# Altium schematic sheet SCH_Display_Altium.schdoc
size 307 x 206 mm
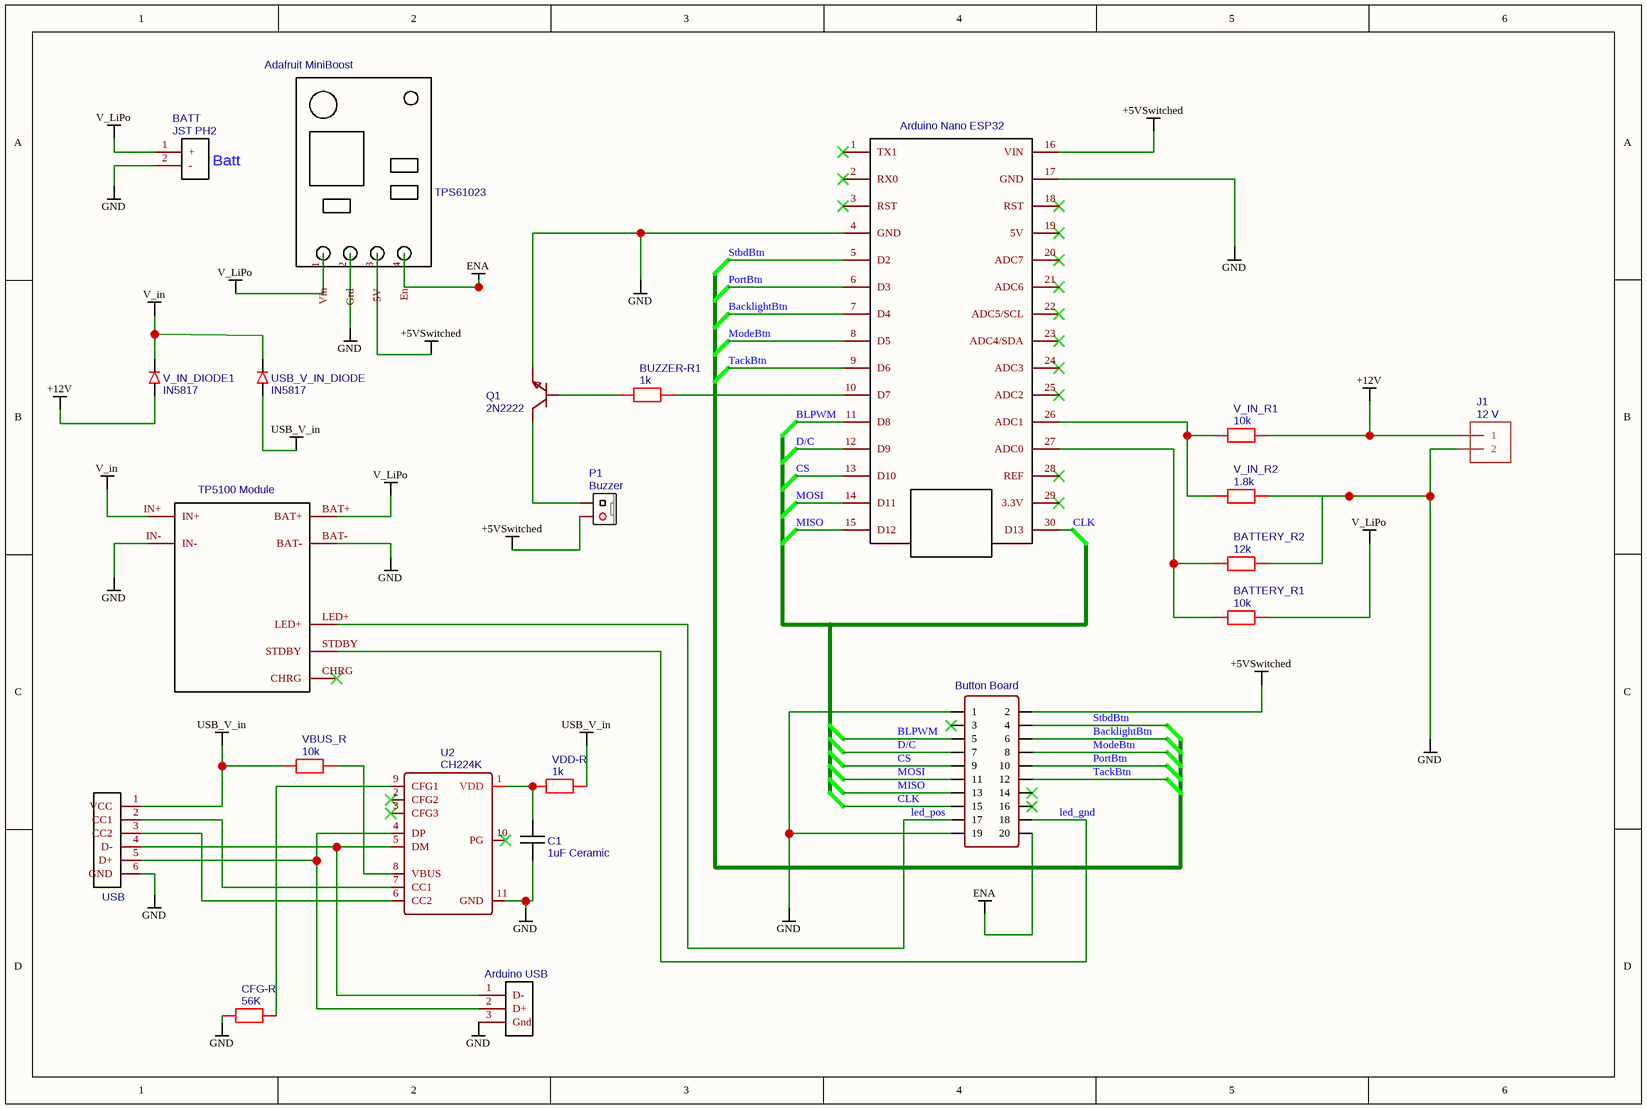
[diagram p0: SCH_Display_Altium.schdoc]

## Parts
BATT  JST PH2  [JST-PH-JST-PH2]
BATTERY_R1  10k  [1K 0.25W]
BATTERY_R2  12k  [1K 0.25W]
BUTTON_LED1  Button Board  [HDR-M-2.54_2X10]
BUZZER-R1  1k  [1K 0.25W]
C1  1uF Ceramic  [CERAMIC CAPACITOR]
CFG-R  56K  [1K 0.25W]
J1  12 V  [1X2-3.5MM]
JST-PH-2.0_1X6  USB  [JST-PH-2.0_1X6]
JST_XH_1X3  Arduino USB  [JST XH 1X3]
P1  Buzzer  [HDR-1X2M-P-2.54MM-JST XH NO]
Q1  2N2222  [TO-92-3_L4.9-W3.7-P1.27-L]
TPS61023  Adafruit MiniBoost  [ADAFRUIT MINIBOOST 5V @ 1A - TPS61023 FOOTPRINT]
U1  Arduino Nano ESP32  [ADUINO NANO R3]
U2  CH224K  [ESSOP-10_L4.9-W3.9-P1.0-LS6.0-TL-EP]
U3  TP5100 Module  [TP5100-MODULE]
USB_V_IN_DIODE  IN5817  [DIODE NI RAMON]
V_IN_DIODE1  IN5817  [DIODE NI RAMON]
V_IN_R1  10k  [1K 0.25W]
V_IN_R2  1.8k  [1K 0.25W]
VBUS_R  10k  [1K 0.25W]
VDD-R  1k  [1K 0.25W]

## Nets
+5VSwitched: BUTTON_LED1.2 P1.2 TPS61023.3(5V) U1.16(VIN)
+12V: J1.1 V_IN_DIODE1.1 V_IN_R1.2
ENA: BUTTON_LED1.20 TPS61023.4(En)
GND: BATT.2(-) BATTERY_R2.2 BUTTON_LED1.1 BUTTON_LED1.19 C1.2 CFG-R.1 J1.2 JST-PH-2.0_1X6.6(GND) JST_XH_1X3.3(Gnd) Q1.1(E) TPS61023.2(Grd) U1.4(GND) U1.17(GND) U2.11(GND) U3.BAT- U3.IN- V_IN_R2.2
USB_V_in: JST-PH-2.0_1X6.1(VCC) USB_V_IN_DIODE.1 VBUS_R.1 VDD-R.2
V_in: U3.IN+ USB_V_IN_DIODE.2 V_IN_DIODE1.2
V_LiPo: BATT.1(+) BATTERY_R1.2 TPS61023.1(Vin) U3.BAT+
BacklightBtn: BUTTON_LED1.6 U1.7(D4)
BLPWM: BUTTON_LED1.5 U1.11(D8)
CLK: BUTTON_LED1.15 U1.30(D13)
CS: BUTTON_LED1.9 U1.13(D10)
D/C: BUTTON_LED1.7 U1.12(D9)
led_gnd: BUTTON_LED1.18 U3.STDBY
led_pos: BUTTON_LED1.17 U3.LED+
MISO: BUTTON_LED1.13 U1.15(D12)
ModeBtn: BUTTON_LED1.8 U1.8(D5)
MOSI: BUTTON_LED1.11 U1.14(D11)
PortBtn: BUTTON_LED1.10 U1.6(D3)
StbdBtn: BUTTON_LED1.4 U1.5(D2)
TackBtn: BUTTON_LED1.12 U1.9(D6)
NetBATTERY_R1_1: BATTERY_R1.1 BATTERY_R2.1 U1.27(ADC0)
NetBUZZER-R1_1: BUZZER-R1.1 Q1.2(B)
NetBUZZER-R1_2: BUZZER-R1.2 U1.10(D7)
NetC1_1: C1.1 U2.1(VDD) VDD-R.1
NetCFG-R_2: CFG-R.2 U2.9(CFG1)
NetJST-PH-2.0_1X6_2: JST-PH-2.0_1X6.2(CC1) U2.7(CC1)
NetJST-PH-2.0_1X6_3: JST-PH-2.0_1X6.3(CC2) U2.6(CC2)
NetJST-PH-2.0_1X6_4: JST-PH-2.0_1X6.4(D-) JST_XH_1X3.1(D-) U2.5(DM)
NetJST-PH-2.0_1X6_5: JST-PH-2.0_1X6.5(D+) JST_XH_1X3.2(D+) U2.4(DP)
NetP1_1: P1.1 Q1.3(C)
NetU1_26: U1.26(ADC1) V_IN_R1.1 V_IN_R2.1
NetU2_8: U2.8(VBUS) VBUS_R.2

Not connected (* = marked no-connect by the designer): BUTTON_LED1 3* 14* 16*; U1 1(TX1)* 2(RX0)* 3(RST)* 18(RST)* 19(5V)* 20(ADC7)* 21(ADC6)* 22(ADC5/SCL)* 23(ADC4/SDA)* 24(ADC3)* 25(ADC2)* 28(REF)* 29(3.3V)*; U2 2(CFG2)* 3(CFG3)* 10(PG)*; U3 CHRG*

## Notes on the sheet
- (in symbol JST PH2) Batt

## Library data of the parts
BATT = JST PH2: Contributor: pwarrow99; spicePre: U; spiceSymbolName: JST PH2
BATTERY_R1 V_IN_R1 VBUS_R = 10k: Contributor: Kagutsuchi; spicePre: R; spiceSymbolName: 1w resistor
BATTERY_R2 = 12k: Contributor: Kagutsuchi; spicePre: R; spiceSymbolName: 1w resistor
BUTTON_LED1 = Button Board: Contributor: LCEDA_Lib; Supplier Part: C124359; Supplier: LCSC; spicePre: J; spiceSymbolName: HDR-M-2.54_2x10
BUZZER-R1 VDD-R = 1k: Contributor: Kagutsuchi; spicePre: R; spiceSymbolName: 1w resistor
C1 = 1uF Ceramic: Manufacturer Part: Capacitor_Ceramic; Contributor: huuvinhz755; spicePre: C; spiceSymbolName: Capacitor_Ceramic
CFG-R = 56K: Contributor: Kagutsuchi; spicePre: R; spiceSymbolName: 1w resistor
J1 = 12 V: Contributor: Adafruit; spicePre: J; spiceSymbolName: TERMBLOCK_1X2-3.5MM
JST-PH-2.0_1X6 = USB: Contributor: yury26nev; Manufacturer Part: JST-PH-2.0_1x6; spicePre: P; spiceSymbolName: JST-PH-2.0_1x6
JST_XH_1X3 = Arduino USB: Contributor: GeMeMe; spicePre: U; spiceSymbolName: JST XH 1x3
P1 = Buzzer: Manufacturer Part: Headers  Pins2.54mm1*10P; Contributor: jousterde1; Supplier: LCSC; image: http://image.lceda.cn/szlcsc/C57369.jpg; Supplier Part: C57369; spicePre: P; spiceSymbolName: HDR-2.54_1x2_N_O
Q1 = 2N2222: Manufacturer: ST(先科); Manufacturer Part: 2N2222A; Contributor: LCSC; Supplier: LCSC; Supplier Part: C118536; JLCPCB Part Class: Extended Part; spicePre: Q; spiceSymbolName: 2N2222
TPS61023 = Adafruit MiniBoost: Contributor: jefflorditch; spicePre: U; spiceSymbolName: Adafruit MiniBoost 5V @ 1A - TPS61023
U1 = Arduino Nano ESP32: Contributor: Nikolay Yanev; spicePre: U; spiceSymbolName: ARDUINO_NANO_R3
U2 = CH224K: Manufacturer: WCH(南京沁恒); Contributor: lcsc; Supplier: LCSC; Supplier Part: C970725; Manufacturer Part: CH224K; JLCPCB Part Class: Extended Part; spicePre: U; spiceSymbolName: CH224K
U3 = TP5100 Module: Contributor: cropemail; Manufacturer Part: TP5100-MODULE; spicePre: U; spiceSymbolName: TP5100-MODULE
USB_V_IN_DIODE V_IN_DIODE1 = IN5817: Manufacturer Part: DIODE; Contributor: mimit.oscar; spicePre: D; spiceSymbolName: in5004 diode
V_IN_R2 = 1.8k: Contributor: Kagutsuchi; spicePre: R; spiceSymbolName: 1w resistor